# EAGLE design smarticle12 (EAGLE 7.2.0)
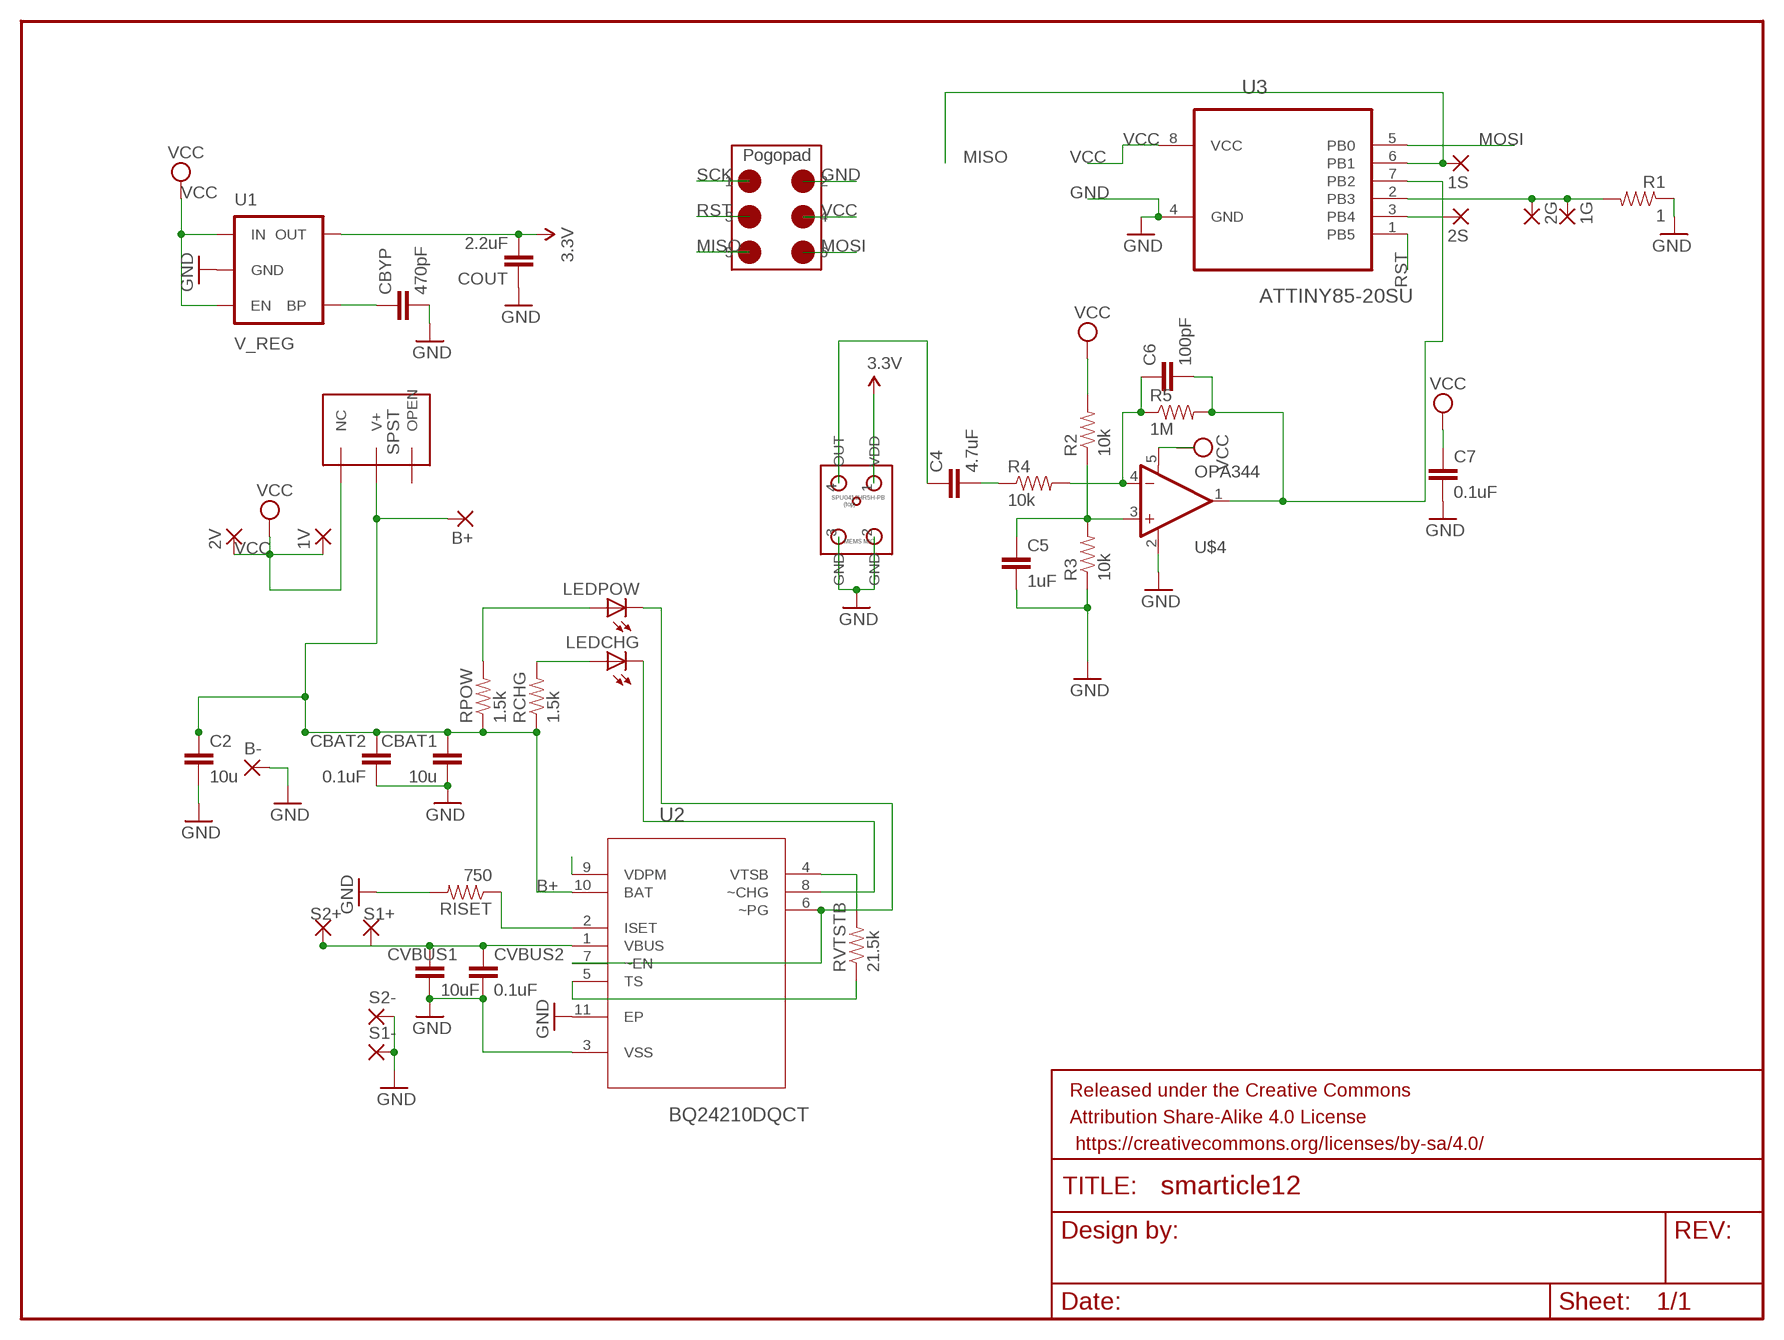
[diagram p0: schematic, sheet 1]

## Parts
1G  1,6/0,8  [1,6/0,8]
1S  1,6/0,8  [1,6/0,8]
1V  1,6/0,8  [1,6/0,8]
2G  1,6/0,8  [1,6/0,8]
2S  1,6/0,8  [1,6/0,8]
2V  1,6/0,8  [1,6/0,8]
B+  1,6/0,8  [1,6/0,8]
B-  1,6/0,8  [1,6/0,8]
C2  10u  CAP0603-CAP  [0603-CAP]
C4  4.7uF  CAP0603-CAP  [0603-CAP]
C5  1uF  CAP0603-CAP  [0603-CAP]
C6  100pF  CAP0603-CAP  [0603-CAP]
C7  0.1uF  CAP0603-CAP  [0603-CAP]
CBAT1  10u  CAP0805  [0805]
CBAT2  0.1uF  CAP0603-CAP  [0603-CAP]
CBYP  470pF  CAP0603-CAP  [0603-CAP]
COUT  2.2uF  CAP0603-CAP  [0603-CAP]
CVBUS1  10uF  CAP1206  [1206]
CVBUS2  0.1uF  CAP0603-CAP  [0603-CAP]
FRAME1  FRAME-LETTERNO_PACKAGE  [DUMMY]
LEDCHG  LEDCHIPLED_0603  [CHIPLED_0603]
LEDPOW  LEDCHIPLED_0603  [CHIPLED_0603]
R1  1  RESISTOR0805-RES  [0805]
R2  10k  RESISTOR0603-RES  [0603-RES]
R3  10k  RESISTOR0603-RES  [0603-RES]
R4  10k  RESISTOR0603-RES  [0603-RES]
R5  1M  RESISTOR0603-RES  [0603-RES]
RCHG  1.5k  RESISTOR0603-RES  [0603-RES]
RISET  750  RESISTOR0603-RES  [0603-RES]
RPOW  1.5k  RESISTOR0603-RES  [0603-RES]
RVTSTB  21.5k  RESISTOR0603-RES  [0603-RES]
S1+  1,6/0,8  [1,6/0,8]
S1-  1,6/0,8  [1,6/0,8]
S2+  1,6/0,8  [1,6/0,8]
S2-  1,6/0,8  [1,6/0,8]
U1  V_REG  V_REG_LDOSMD  [SOT23-5]
U2  BQ24210DQCT  [SON50P200X300X80-11N]
U3  ATTINY85-20SU  [SOIC127P798X216-8N]
U$1  2X3POGOPADS  [3X2POGOPADS]
U$2  WILL_SWITCH  [WILL-SWITCH]
U$3  MEMSMICRO  [MEMSMIC]
U$4  OPA344  [SOT23-5]

## Nets
3.3V: COUT.2 U1.5(OUT) U$3.1(VDD)
B+: B+.1(P) C2.1 CBAT1.1 CBAT2.1 RCHG.1 RPOW.1 U2.10(BAT) U$2.V+
GND: B-.1(P) C2.2 C5.2 C7.2 CBAT1.2 CBAT2.2 CBYP.2 COUT.1 CVBUS1.2 CVBUS2.2 R1.1 R3.1 RISET.2 S1-.1(P) S2-.1(P) U1.2(GND) U2.3(VSS) U2.11(EP) U3.4(GND) U$1.2 U$3.2(GND) U$3.3(GND) U$4.2(V-)
MISO: 1S.1(P) U3.6(PB1) U$1.5
MOSI: U3.5(PB0) U$1.6
N$2: 2S.1(P) U3.3(PB4)
N$3: LEDPOW.A RPOW.2
N$4: LEDCHG.A RCHG.2
N$5: CBYP.1 U1.4(BP)
N$6: RVTSTB.1 U2.5(TS)
N$7: RVTSTB.2 U2.4(VTSB)
N$8: 1G.1(P) 2G.1(P) R1.2 U3.2(PB3)
N$9: CVBUS1.1 CVBUS2.1 S1+.1(P) S2+.1(P) U2.1(VBUS)
N$10: LEDPOW.C U2.6(~PG) U2.7(~EN)
N$11: RISET.1 U2.2(ISET)
N$13: C4.1 U$3.4(OUT)
N$15: LEDCHG.C U2.8(~CHG)
N$18: C4.2 R4.1
N$19: U2.9(VDPM)
N$20: C5.1 R2.1 R3.2 U$4.3(+IN)
N$21: C6.1 R4.2 R5.1 U$4.4(-IN)
RST: U3.1(PB5) U$1.3
SCK: C6.2 R5.2 U3.7(PB2) U$1.1 U$4.1(OUT)
VCC: 1V.1(P) 2V.1(P) C7.1 R2.2 U1.1(IN) U1.3(EN) U3.8(VCC) U$1.4 U$2.NC U$4.5(V+)
Unconnected: U$2.OPEN

## Library data of the parts
1G 1S 1V 2G 2S 2V B+ B- S1+ S1- S2+ S2- = wirepad:1,6/0,8: THROUGH-HOLE PAD
C2 C4-C7 CBAT1 CBAT2 CBYP COUT CVBUS1 CVBUS2 = SparkFun-Passives:CAP: Capacitor Standard 0603 ceramic capacitor, and 0.1" leaded capacitor.
FRAME1 = SparkFun-Aesthetics:FRAME-LETTER: Schematic Frame Standard 8.5x11 US Letter frame; DESIGNER: Nobody; VERSION: v01
LEDCHG LEDPOW = led:LED: LED OSRAM: - CHIPLED LG R971, LG N971, LY N971, LG Q971, LY Q971, LO R971, LY R971 LH N974, LH R974 LS Q976, LO Q976, LY Q976 LO Q996 - Hyper CHIPLED LW Q18S LB Q993, LB Q99A, LB R99A - SideLED LS A670, LO A670, LY A670, LG A670, LP A670 LB A673, LV A673, LT A673, LW A673 LH A674 LY A675 LS A676, LA A676, LO A676, LY A676, LW A676 LS A679, LY A679, LG A679 - Hyper Micro SIDELED® LS Y876, LA Y876, LO Y876, LY Y876 LT Y87S - SmartLED LW L88C, LW L88S LB L89C, LB L89S, LG L890 LS L89K, LO L89K, LY L89K LS L896, LA L896, LO L896, LY L896 - TOPLED LS T670, LO T670, LY T670, LG T670, LP T670 LSG T670, LSP T670, LSY T670, LOP T670, LYG T670 LG T671, LOG T671, LSG T671 LB T673, LV T673, LT T673, LW T673 LH T674 LS T676, LA T676, LO T676, LY T676, LB T676, LH T676, LSB T676, LW T676 LB T67C, LV T67C, LT T67C, LS T67K, LO T67K, LY T67K, LW E67C LS E67B, LA E67B, LO E67B, LY E67B, LB E67C, LV E67C, LT E67C LW T67C LS T679, LY T679, LG T679 LS T770, LO T770, LY T770, LG T770, LP T770 LB T773, LV T773, LT T773, LW T773 LH T774 LS E675, LA E675, LY E675, LS T675 LS T776, LA T776, LO T776, LY T776, LB T776 LHGB T686 LT T68C, LB T68C - Hyper Mini TOPLED® LB M676 - Mini TOPLED Santana® LG M470 LS M47K, LO M47K, LY M47K Source: http://www.osram.convergy.de LUXEON: - LUMILED® LXK2-PW12-R00, LXK2-PW12-S00, LXK2-PW14-U00, LXK2-PW14-V00 LXK2-PM12-R00, LXK2-PM12-S00, LXK2-PM14-U00 LXK2-PE12-Q00, LXK2-PE12-R00, LXK2-PE12-S00, LXK2-PE14-T00, LXK2-PE14-U00 LXK2-PB12-K00, LXK2-PB12-L00, LXK2-PB12-M00, LXK2-PB14-N00, LXK2-PB14-P00, LXK2-PB14-Q00 LXK2-PR12-L00, LXK2-PR12-M00, LXK2-PR14-Q00, LXK2-PR14-R00 LXK2-PD12-Q00, LXK2-PD12-R00, LXK2-PD12-S00 LXK2-PH12-R00, LXK2-PH12-S00 LXK2-PL12-P00, LXK2-PL12-Q00, LXK2-PL12-R00 Source: www.luxeon.com KINGBRIGHT: KA-3528ASYC Source: www.kingbright.com
R1 = SparkFun-Resistors:RESISTOR: Resistor Basic schematic elements and footprints for 0603, 1206, and PTH resistors.
R2-R5 RCHG RISET RPOW RVTSTB = SparkFun-Passives:RESISTOR: Resistor Basic schematic elements and footprints for 0603, 1206, and PTH resistors.
U1 = SparkFun-PowerIC:V_REG_LDO: Voltage Regulator LDO Standard 150mA LDO voltage regulator in SOT-23 layout. Micrel part MIC5205. BP (by-pass) pin is used to lower output noise with 470pF cap.
U2 = Texas Instruments_By_element14_Batch_1:BQ24210DQCT: Single Cell Li-Ion Battery Solar Charger; MPN: BQ24210DQCT; OC_FARNELL: 1903633; OC_NEWARK: 56T0491; PACKAGE: SON-10; SUPPLIER: TEXAS INSTRUMENTS
U3 = Atmel_By_element14_Batch_1-00:ATTINY85-20SU: 8-bit Microcontroller with In-System Programmable Flash; MPN: ATTINY85-20SU; OC_FARNELL: 1455164; OC_NEWARK: 58M3797; PACKAGE: SOIC-8; SUPPLIER: Atmel
U$1 = Will_pogopins:2X3POGOPADS
U$2 = Will-Switch:WILL_SWITCH
U$3 = Will-memsmic:MEMSMICRO
U$4 = SparkFun-AnalogIC:OPA344: Single gate rail-to-rail output op-amp. Inputs extend 300mV past rails.

## Board
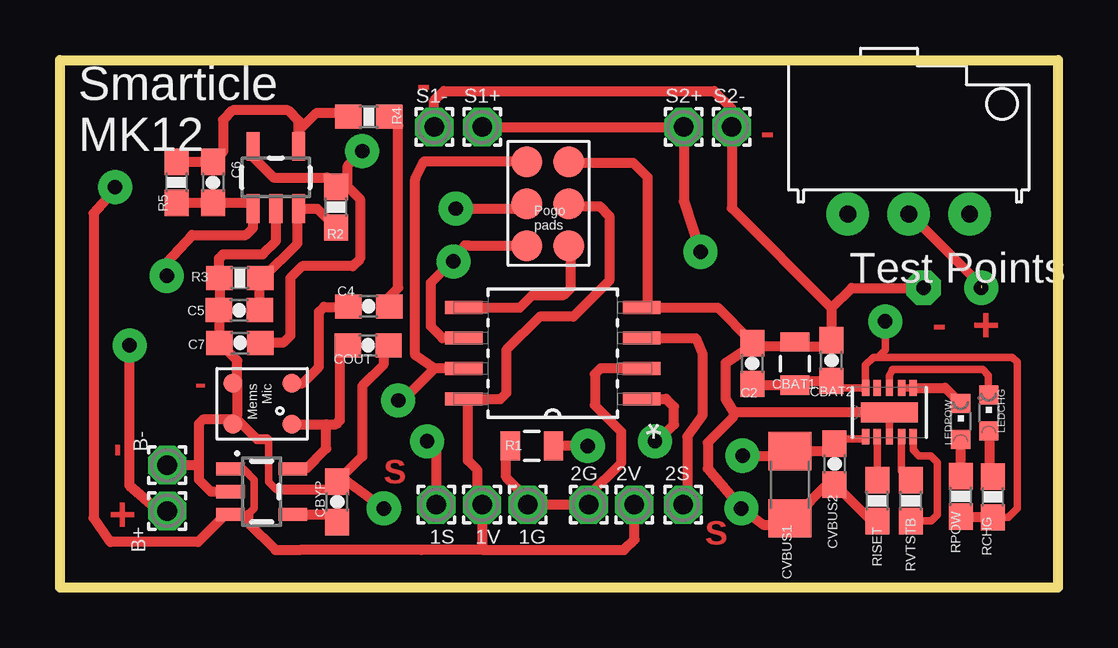
[diagram p1: board, top side]
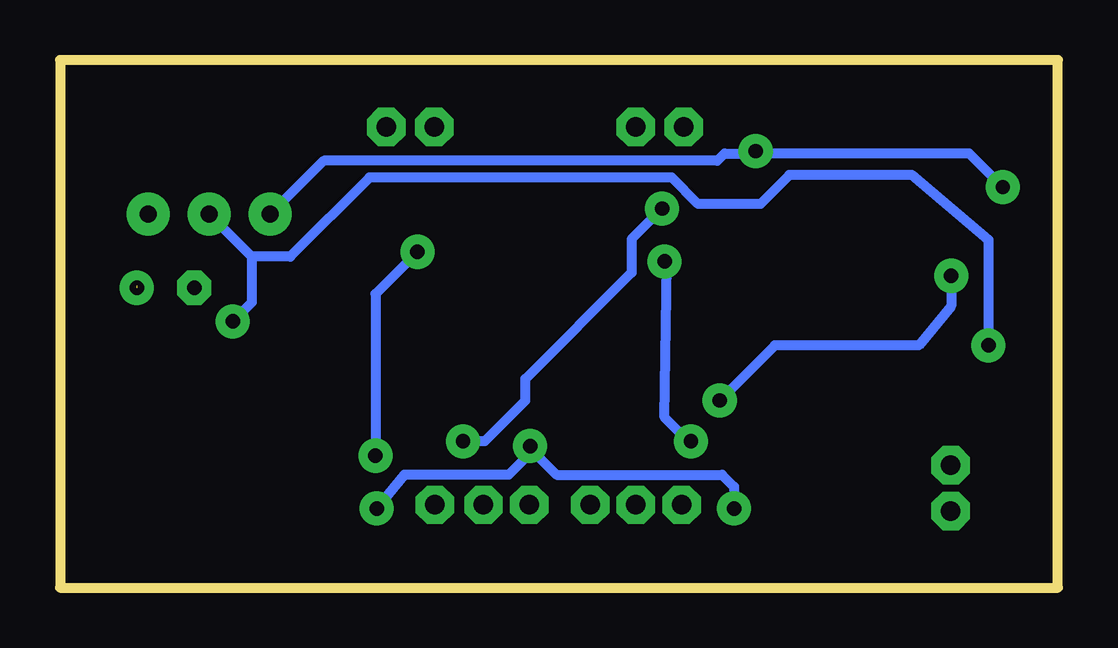
[diagram p2: board, bottom side, seen from below]

Size 41.6 x 22 mm. Coordinates in mm from the lower left corner, seen from the top.
Outline: 0,0 0,22 41.6,22 41.6,0 0,0
Copper layers (1*16): Top 0.035mm / dielectric 1.5mm / Bottom 0.035mm
Design rules "SparkFun": minimum track width 8mil, minimum drill 20mil, track to track 8mil, track to pad 8mil, pad to pad 8mil, via to via 8mil, smd to smd 8mil, copper to edge 8mil, drill to drill 8mil, minimum pad ring 12mil, minimum via ring 10mil, stop-mask expansion 4mil, vias tented up to drill 20mil, thermal gap 10mil

### Footprints (pad centres in the part's own frame; a part is rotated, then mirrored left to right if it is on the bottom)
1,6/0,8 = drill 0.813 pad 1.6 octagon: 1 0,0
0603-CAP = smd 1.1 x 1: 1 -0.85,0; 2 0.85,0
0805 = smd 0.8 x 1.2: 1 -0.9,0; 2 0.9,0
1206 = smd 1.6 x 1.8: 1 -1.4,0; 2 1.4,0
CHIPLED_0603 = smd 0.8 x 0.8: A 0,-0.75; C 0,0.75
0603-RES = smd 1.1 x 1: 1 -0.85,0; 2 0.85,0
SOT23-5 = smd 0.55 x 1.2: 1 -0.95,-1.3; 2 0,-1.3; 3 0.95,-1.3; 4 0.95,1.3; 5 -0.95,1.3
SON50P200X300X80-11N = smd 0.66 x 0.305: 1 -1.016,0.991; 2 -1.016,0.508; 3 -1.016,0; 4 -1.016,-0.508; 5 -1.016,-0.991; 6 1.016,-0.991; 7 1.016,-0.508; 8 1.016,0; 9 1.016,0.508; 10 1.016,0.991 | smd 0.838 x 2.388: 11 0,0
SOIC127P798X216-8N = smd 1.549 x 0.533: 1 -3.708,1.905; 2 -3.708,0.635; 3 -3.708,-0.635; 4 -3.708,-1.905; 5 3.708,-1.905; 6 3.708,-0.635; 7 3.708,0.635; 8 3.708,1.905
3X2POGOPADS = smd 1.3 x 1.3: 1 0.8,4.3; 2 2.55,4.3; 3 0.8,2.55; 4 2.55,2.55; 5 0.8,0.8; 6 2.55,0.8
WILL-SWITCH = drill 0.7 pad 1.778: NC 6.93,2.46; OPEN 6.93,7.54; V+ 6.93,5
MEMSMIC = smd 0.8 x 0.8: 1 2.325,3.11; 2 2.325,0.65; 3 0.625,0.65; 4 0.625,3.11

### Placement (x,y rotation side)
1G  19.5,3.45 180 top
1S  15.69,3.45 180 top
1V  17.59,3.45 180 top
2G  22.04,3.45 0 top
2S  25.98,3.45 0 top
2V  23.94,3.45 0 top
B+  4.47,3.19 90 top
B-  4.47,5.1 90 top
C2  28.86,9.34 90 top
C4  12.87,11.73 0 top
C5  7.48,11.57 180 top
C6  6.38,16.9 270 top
C7  7.5,10.2 180 top
CBAT1  30.64,9.34 90 top
CBAT2  32.16,9.47 90 top
CBYP  11.56,3.57 90 top
COUT  12.85,10.1 180 top
CVBUS1  30.43,4.28 270 top
CVBUS2  32.29,5.15 270 top
FRAME1  0.5,0.5 0 top
LEDCHG  38.71,7.28 0 top
LEDPOW  37.54,6.93 0 top
R1  19.67,5.91 180 top
R2  11.51,15.86 90 top
R3  7.5,12.9 0 top
R4  12.88,19.64 180 top
R5  4.86,16.9 270 top
RCHG  38.89,3.78 90 top
RISET  34.06,3.62 270 top
RPOW  37.54,3.8 90 top
RVTSTB  35.46,3.62 90 top
S1+  17.6,19.2 0 top
S1-  15.6,19.2 0 top
S2+  26,19.2 0 top
S2-  28,19.2 0 top
U1  8.41,4 270 top
U2  34.57,7.31 90 top
U3  20.54,9.77 180 top
U$1  18.66,13.45 0 top
U$2  30.38,22.5 270 top
U$3  6.55,9.14 270 top
U$4  9,17.1 0 top

### Tracks (layer width: path | path; a pad name or v marks a point on that pad's centre or on a via)
3.3V
  Top 0.305: U$3.1
  Top 0.406: COUT.2 11.66,10.05 11.66,6.97 11.5,6.81 | 11.5,6.81 | U$3.1 11.1,6.81 | 11.1,6.81 11.5,6.81 | U1.5 10.25,4.95 11.1,5.8 11.1,6.81
B+  (via drill 0.6 pad 1.42)  (1 unrouted)
  Top 0.305: RCHG.1 39.53,2.93 39.9,3.3 39.9,9.4 39.7,9.6 34.1,9.6 | 34.1,9.6 33.9,9.6 33.58,9.28 U2.10 32.45,8.32 CBAT2.1 | v34.4,11.1 34.4,9.9 34.1,9.6
  Top 0.406: B+.1 4.11,3.19 2.9,4.25 v2.9,10.1 | C2.1 28.86,8.44 CBAT1.1 30.64,8.62 CBAT2.1 | RPOW.1 38.87,2.95 RCHG.1 | U$2.V+ 35.43,15.57 38.4,12.6
  Bottom 0.406: 33.61,13.8 32,13.8 28.7,17.1 16.1,17.1 15,16 12.4,16 11.2,17.2 6.1,17.2 2.9,14.5 v2.9,10.1 | v34.4,11.1 33.61,11.89 33.61,13.8 | 33.61,13.8 U$2.V+
  other vias: 38.4,12.5
GND  (via drill 0.6 pad 1.42)
  Top 0.305: 30.76,10.24 CBAT1.2 | 7.39,7.21 U$3.2 | 7.39,8.63 U$3.3 | 11.45,4.56 CBYP.2 | 7.39,7 U$3.2 | 13.49,10.05 COUT.1 13.69,10.25 | 11.66,4.56 CBYP.2 | 7.19,7 U$3.2 | 31.83,4.16 32.24,4.16 CVBUS2.2 32.44,4.16 | 33.66,2.94 34.06,2.94 RISET.2 | 28.98,10.05 C2.2 | 30.61,10.05 CBAT1.2 | 32.24,10.05 CBAT2.2 32.44,10.05 | 30.81,10.05 CBAT1.2 | 28.78,10.05 C2.2 | 21.4,17.57 U$1.2 | 34.47,7.33 U2.11 U2.3 | 28.83,10.09 C2.2 | 11.23,4.1 CBYP.2 | 9.1,4.1 9,4.1 8.7,4.4 8.7,6.12 8.63,6.19 | 30.61,2.94 30.81,3.14 CVBUS1.2 30.61,2.94
  Top 0.406: 7.39,7.21 7.39,8.63 7.39,9.46 C7.2 6.65,11.6 C5.2 6.65,11.59 R3.1 6.63,13.07 6.63,13.73 6.8,13.9 8.45,13.9 9,14.45 U$4.2 | 7.39,7 8.2,6.19 8.63,6.19 | 30.81,3.14 31.83,4.16 | 32.44,4.16 33.66,2.94 | 30.61,10.05 28.98,10.05 | 30.81,10.05 32.24,10.05 | 28.78,10.05 27.74,9.37 27.74,7.86 28.07,7.33 | 28.07,7.33 34.47,7.33 | 7.19,7 5.97,7 5.8,6.83 5.8,5 | B-.1 5.7,5.1 5.8,5 | 9.1,4.1 11.23,4.1 | S1-.1 15.6,20.3 16,20.7 27.26,20.7 28,19.96 S2-.1 28,15.82 32.16,11.66 | U1.2 6.3,4 5.8,4.5 5.8,5 | 13.49,10.05 13.49,9.29 12.6,8.4 12.6,5.47 CBYP.2 11.98,4.42 v13.5,3.3 | CVBUS1.2 30.15,2.6 29.35,2.6 v28.4,3.3 27,4.95 27,6.05 28.07,7.12 28.07,7.33 | v22,5.9 20.58,5.9 R1.1 | 32.16,11.66 33,12.5 v36,12.5 | 32.16,11.66 CBAT2.2 | 28.83,10.09 28.83,10.27 27.43,11.68 U3.4 24.5,11.93 24.5,17.1 23.9,17.7 21.27,17.7 U$1.2
  Bottom 0.406: v28.4,3.3 27.25,4.7 22.9,4.7 22,5.6 v22,5.9 22,5.8 20.9,4.7 14,4.7 13.5,4.2 v13.5,3.3
MISO  (via drill 0.6 pad 1.42)
  Top 0.305: 19.42,14.22 U$1.5
  Top 0.406: U$1.5 17.03,14.27 16.87,14.27 v16.4,13.6 16.35,13.6 15.45,12.7 15.45,10.9 15.94,10.41 U3.6 | 1S.1 15.69,5.71 v15.3,6.1
  Bottom 0.406: v15.3,6.1 15.4,6.1 16.4,7.1 16.3,13.5 v16.4,13.6
MOSI
  Top 0.305: 21.2,14.11 U$1.6
  Top 0.406: U3.5 19.18,11.68 19.7,12.2 21,12.2 21.3,12.5 21.3,14.16 U$1.6
N$2
  Top 0.406: U3.3 26.5,10.41 26.8,9.71 26.8,7.2 26.15,6.3 26.15,3.77 2S.1
N$3
  Top 0.406: RPOW.2 LEDPOW.A
N$4
  Top 0.305: 38.76,6.62 LEDCHG.A | 38.76,4.79 RCHG.2
  Top 0.406: 38.76,4.79 38.76,6.62
N$5
  Top 0.406: U1.4 11.23,3.05 CBYP.1
N$6
  Top 0.305: 35.49,2.73 RVTSTB.1 36.31,2.77 36.58,3.04 36.58,5.22 36.3,5.5 35.8,5.5 35.56,5.74 U2.5
N$7
  Top 0.305: 35.08,4.86 RVTSTB.2 35.08,4.97 U2.4
N$8
  Top 0.406: R1.2 18.6,5.74 18.6,4.6 19.5,3.7 1G.1 2G.1 22.04,3.84 23.4,5.2 23.4,6.5 22.3,7.6 22.3,8.9 22.54,9.14 U3.2
N$9  (via drill 0.6 pad 1.42)
  Top 0.305: U2.1 33.45,6.19 32.44,6.19 CVBUS2.1
  Top 0.406: S1+.1 S2+.1 26,16.1 v26.7,14 | CVBUS2.1 31.99,5.7 30.42,5.7 CVBUS1.1 30.25,5.5 v28.45,5.5
  Bottom 0.406: v26.7,14 28.45,12.25 v28.45,5.5
N$10
  Top 0.305: U2.7 U2.6
  Top 0.406: U2.6 36.9,8.32 LEDPOW.C
N$11
  Top 0.305: RISET.1 U2.2
N$13
  Top 0.406: U$3.4 10.11,8.51 10.8,9.2 10.8,11.5 11,11.7 12,11.7 C4.1
N$15
  Top 0.305: U2.8 34.57,8.83 34.7,9.09 38.47,9.09 38.7,8.85 38.7,8.04 LEDCHG.C
N$18
  Top 0.406: C4.2 13.72,12.12 14.1,12.5 14.1,19.27 R4.1
N$20
  Top 0.406: C5.1 8.33,12.88 R3.2 8.45,12.9 9.9,14.35 9.9,15.75 U$4.3 10.72,15.8 R2.1
N$21
  Top 0.406: R5.1 C6.1 6.8,18.16 6.8,19.5 7.2,19.9 9.5,19.9 9.95,19.45 U$4.4 9.95,19.05 10.7,19.8 11.87,19.8 R4.2
RST  (via drill 0.6 pad 1.42)
  Top 0.305: U3.1 24.5,7.87
  Top 0.406: v16.5,15.8 19.26,15.8 U$1.3 | U3.1 25.27,7.87 25.6,7.53 25.6,6.8 24.9,6.1 v24.8,6.1
  Bottom 0.406: v16.5,15.8 17.77,14.53 17.77,13.13 22.2,8.7 22.2,7.8 23.9,6.1 v24.8,6.1
SCK  (via drill 0.6 pad 1.42)
  Top 0.305: 19.44,17.77 U$1.1
  Top 0.406: U3.7 15.61,9.14 | 15.61,9.14 14.8,9.69 14.8,17.04 15.19,17.77 19.44,17.77 | v14.1,7.8 14.28,7.8 15.61,9.14 | R5.2 C6.2 7.8,16.05 U$4.1 8.05,15 7.75,14.7 5.5,14.7 4.45,13.55 v4.45,13
  Bottom 0.406: 14.04,7.74 v14.1,7.8 11.8,10.1 5.8,10.1 4.45,11.75 v4.45,13
VCC  (via drill 0.6 pad 1.42)
  Top 0.305: 17.59,1.62 17.64,1.57 | U1.3 7.85,3.05 8.1,3.3 8.1,4.5 7.65,4.95 U1.1 | 10,1.56 10,1.57
  Top 0.406: 10,1.57 15.05,1.57 17.64,1.57 23.52,1.57 23.95,2 2V.1 | 17.59,1.62 1V.1 17.4,3.64 17.4,4.9 17,5.3 17,7.7 U3.8 16.85,7.85 18.35,7.85 18.6,8.1 18.6,9.9 20,11.3 21.4,11.3 22.9,12.8 22.9,15.5 22.5,15.9 21.32,15.9 U$1.4 21.5,16 | 10,1.56 8.98,1.56 7.85,2.69 7.85,3.05 | U1.3 7.11,3.04 6.89,3.04 5.75,1.9 2.1,1.9 1.4,2.9 1.4,15.6 2.3,16.6 v2.3,16.7 | U$4.5 8.05,17.95 8.9,17.1 11.12,17.1 R2.2 11.99,16.71 | 11.99,16.71 12.5,16.2 12.5,13.7 12.2,13.4 10.1,13.4 9.6,12.9 9.6,10.5 9.3,10.2 C7.1 | 11.99,16.71 11.99,17.59 v12.6,18.2
  Bottom 0.406: U$2.NC 30.61,17.8 14.2,17.8 13.9,18.1 12.7,18.1 v12.6,18.2 12.5,18.1 3.7,18.1 v2.3,16.7

### Text on the board
Top: - | - | - | + | - | - | S | + | S
tPlace: Smarticle / MK12
tNames: Test Points
Document: Solar | sck gnd / rst vcc / miso mosi | Batt | Servo 1 | Servo 2